# Altium schematic sheet lcdi2c.SchDoc
size A
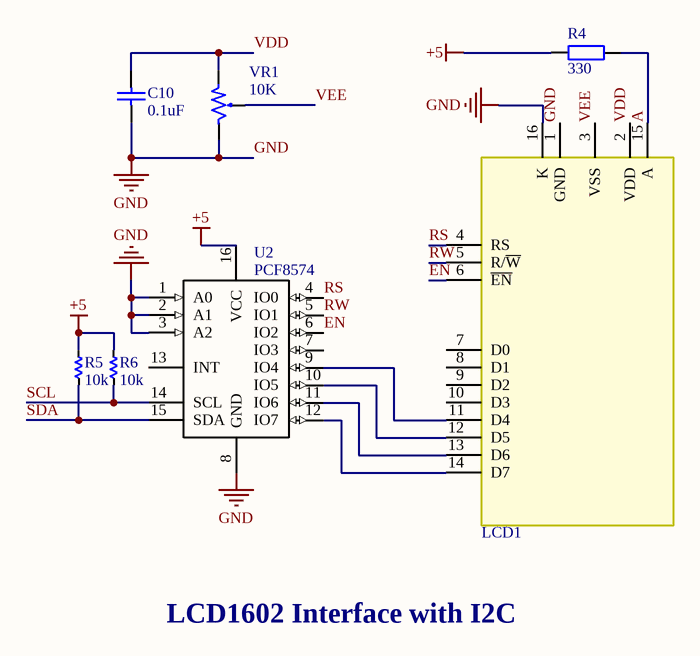
[diagram p0: lcdi2c.SchDoc]

## Parts
C10  0.1uF  [CNP]
LCD1  LCD16x2A  [LCD16X2]  (value not drawn)
R4  330  [R1/4W]
R5  10k  [RES-SMD-0805]
R6  10k  [RES-SMD-0805]
U2  PCF8574  [SO16L]
VR1  10K  [VR]

## Nets
+5: R4.1 R5.1 R6.1 U2.16(VCC)
GND: C10.1 LCD1.1(GND) LCD1.16(K) U2.1(A0) U2.2(A1) U2.3(A2) U2.8(GND) VR1.3
A: LCD1.15(A) R4.2
EN: LCD1.6(~{EN}) U2.6(IO2)
RS: LCD1.4(RS) U2.4(IO0)
RW: LCD1.5(R/~{W}) U2.5(IO1)
SCL: R6.2 U2.14(SCL)
SDA: R5.2 U2.15(SDA)
VDD: C10.2 LCD1.2(VDD) VR1.1
VEE: LCD1.3(VSS) VR1.2
NetLCD1_11: LCD1.11(D4) U2.9(IO4)
NetLCD1_12: LCD1.12(D5) U2.10(IO5)
NetLCD1_13: LCD1.13(D6) U2.11(IO6)
NetLCD1_14: LCD1.14(D7) U2.12(IO7)

Not connected (* = marked no-connect by the designer): LCD1 7(D0) 8(D1) 9(D2) 10(D3); U2 7(IO3) 13(INT)

## Notes on the sheet
- LCD1602 Interface with I2C

## Library data of the parts
C10 = Cap Semi: Capacitor (Semiconductor SIM Model); Value: 104; LatestRevisionDate: 17-Jul-2002; LatestRevisionNote: Re-released for DXP Platform.; PackageReference: C1206; Publisher: Altium Limited
LCD1 = LCD16x2: LCD dipslay 16 char, 2 line; Value: LCD16x2A
R4 = R1/4W: Resistor 1/4W; Value: R1/4W - 1K
R5 R6 = Res-SMD: Resistor; Manufacturer: Generic Components; Class: Passive; Published: 08/06/2000; Publisher: Altium Hobart Technology Centre
U2 = PCF8574: I2C PORT EXPANDER; Manufacturer Part Number: PCF8574T/3,512; Manufacturer: NXP Semiconductors; Includes: POR; Interface: I²C; Interrupt Output: Yes; Number of I /O: 8; Voltage - Supply: 2.5 V ~ 6 V; Frequency - Clock: 100KHz; Supplier 1: Digi-Key; Supplier Part Number 1: 568-1076-5-ND; Package / Case: 16-SOIC (7.5mm Width); Category: Integrated Circuits (ICs); Supplier Part Number: 568-1076-5-ND; Operating Temperature: -40°C ~ 85°C; Packaging: Tube; RoHS: RoHS Compliant; Supplier: Digi-Key
VR1 = VR1: Var Resistor; Value: VR 10K